# EAGLE design MatrixDriver (EAGLE 6.5.0)
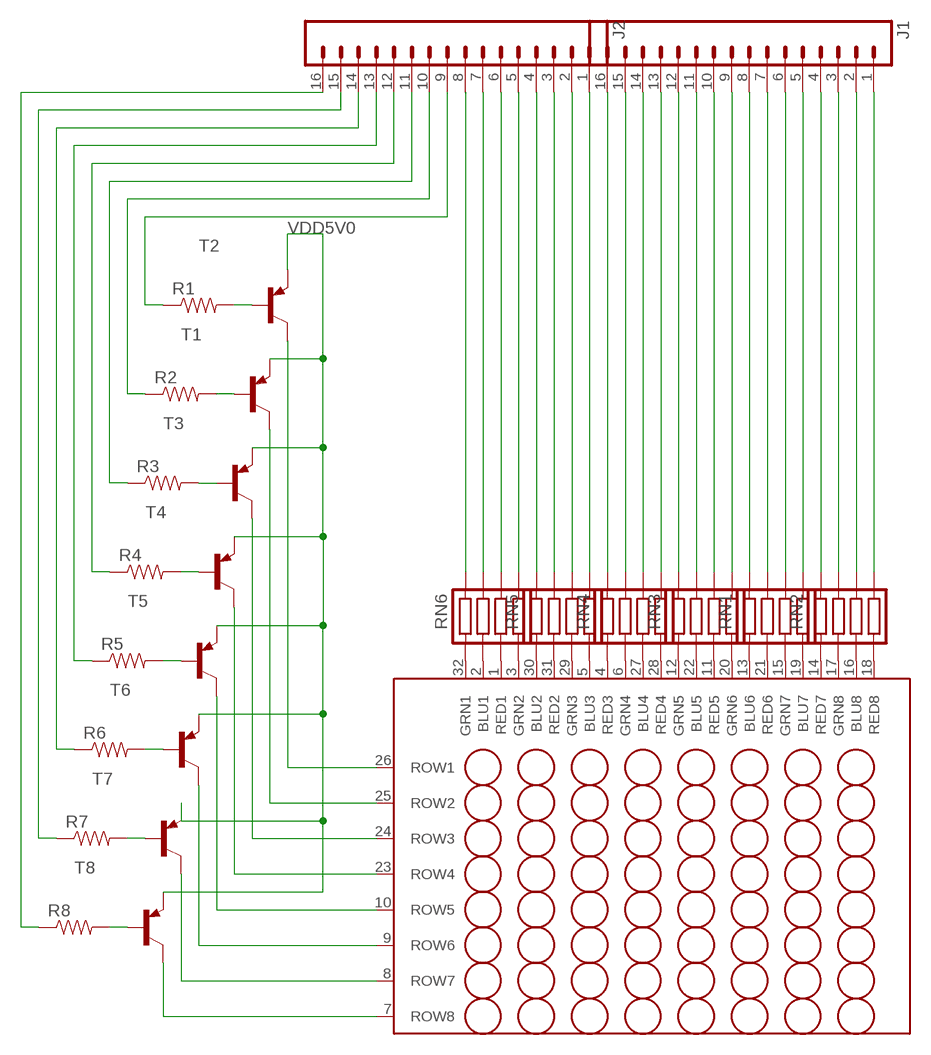
[diagram p0: schematic, sheet 1]

## Parts
J1  M16DUAL_ROW  [2X8]
J2  M16DUAL_ROW  [2X8]
R1  RESISTOR0805-RES  [0805]
R2  RESISTOR0805-RES  [0805]
R3  RESISTOR0805-RES  [0805]
R4  RESISTOR0805-RES  [0805]
R5  RESISTOR0805-RES  [0805]
R6  RESISTOR0805-RES  [0805]
R7  RESISTOR0805-RES  [0805]
R8  RESISTOR0805-RES  [0805]
RN1  RESISTOR_ARRAY-4  [EXB-38V271JV]
RN2  RESISTOR_ARRAY-4  [EXB-38V271JV]
RN3  RESISTOR_ARRAY-4  [EXB-38V271JV]
RN4  RESISTOR_ARRAY-4  [EXB-38V271JV]
RN5  RESISTOR_ARRAY-4  [EXB-38V271JV]
RN6  RESISTOR_ARRAY-4  [EXB-38V271JV]
T1  2N3906-PNP-TO92-EBC  [TO92-EBC]
T2  2N3906-PNP-TO92-EBC  [TO92-EBC]
T3  2N3906-PNP-TO92-EBC  [TO92-EBC]
T4  2N3906-PNP-TO92-EBC  [TO92-EBC]
T5  2N3906-PNP-TO92-EBC  [TO92-EBC]
T6  2N3906-PNP-TO92-EBC  [TO92-EBC]
T7  2N3906-PNP-TO92-EBC  [TO92-EBC]
T8  2N3906-PNP-TO92-EBC  [TO92-EBC]
U$1  BL-M23B88RGB-11  [8X8RGBMATRIX]

## Nets
N$1: T2.C U$1.26(ROW1)
N$2: T1.C U$1.25(ROW2)
N$3: T3.C U$1.24(ROW3)
N$4: T4.C U$1.23(ROW4)
N$5: T5.C U$1.10(ROW5)
N$6: T6.C U$1.9(ROW6)
N$7: T7.C U$1.8(ROW7)
N$8: T8.C U$1.7(ROW8)
N$9: RN1.P$5 U$1.19(BLU7)
N$10: RN1.P$6 U$1.15(GRN7)
N$11: RN1.P$7 U$1.21(RED6)
N$12: RN1.P$8 U$1.13(BLU6)
N$13: RN2.P$5 U$1.18(RED8)
N$14: RN2.P$6 U$1.16(BLU8)
N$15: RN2.P$7 U$1.17(GRN8)
N$16: RN2.P$8 U$1.14(RED7)
N$17: RN3.P$5 U$1.20(GRN6)
N$18: RN3.P$6 U$1.11(RED5)
N$19: RN3.P$7 U$1.22(BLU5)
N$20: RN3.P$8 U$1.12(GRN5)
N$21: RN4.P$5 U$1.28(RED4)
N$22: RN4.P$6 U$1.27(BLU4)
N$23: RN4.P$7 U$1.6(GRN4)
N$24: RN4.P$8 U$1.4(RED3)
N$25: RN5.P$5 U$1.5(BLU3)
N$26: RN5.P$6 U$1.29(GRN3)
N$27: RN5.P$7 U$1.31(RED2)
N$28: RN5.P$8 U$1.30(BLU2)
N$29: RN6.P$5 U$1.3(GRN2)
N$30: RN6.P$6 U$1.1(RED1)
N$31: RN6.P$7 U$1.2(BLU1)
N$32: RN6.P$8 U$1.32(GRN1)
N$33: J1.13 RN4.P$4
N$34: J1.14 RN4.P$3
N$35: J1.15 RN4.P$2
N$36: J1.16 RN4.P$1
N$37: J1.9 RN3.P$4
N$38: J1.10 RN3.P$3
N$39: J1.11 RN3.P$2
N$40: J1.12 RN3.P$1
N$41: J1.5 RN1.P$4
N$42: J1.6 RN1.P$3
N$43: J1.7 RN1.P$2
N$44: J1.8 RN1.P$1
N$45: J1.1 RN2.P$4
N$46: J1.2 RN2.P$3
N$47: J1.3 RN2.P$2
N$48: J1.4 RN2.P$1
N$49: J2.5 RN6.P$4
N$50: J2.6 RN6.P$3
N$51: J2.7 RN6.P$2
N$52: J2.8 RN6.P$1
N$53: J2.1 RN5.P$4
N$54: J2.2 RN5.P$3
N$55: J2.3 RN5.P$2
N$56: J2.4 RN5.P$1
N$57: J2.9 R1.1
N$58: J2.10 R2.1
N$59: J2.11 R3.1
N$60: J2.12 R4.1
N$61: J2.13 R5.1
N$62: J2.14 R6.1
N$63: J2.15 R7.1
N$64: J2.16 R8.1
ROW1: R1.2 T2.B
ROW2: R2.2 T1.B
ROW3: R3.2 T3.B
ROW4: R4.2 T4.B
ROW5: R5.2 T5.B
ROW6: R6.2 T6.B
ROW7: R7.2 T7.B
ROW8: R8.2 T8.B
VDD5V0: T1.E T2.E T3.E T4.E T5.E T6.E T7.E T8.E

## Library data of the parts
J1 J2 = ASL:M16: Header 16 Standard 16-pin 0.1" header. Male version: taken from http://search.digikey.com/scripts/DkSearch/dksus.dll?Detail&name=SAM1034-50-ND Female Version:
R1-R8 = ASL:RESISTOR: Resistor Basic schematic elements and footprints for 0603, 1206, and PTH resistors.
RN1-RN6 = ASL:RESISTOR_ARRAY-4: Chip Resistor Array 4 Single Resistor Source: http://industrial.panasonic.com/www-data/pdf/AOC0000/AOC0000PE2.pdf; OC_FARNELL: unknown; OC_NEWARK: unknown
T1-T8 = transistor-neu-to92:*-PNP-: PNP Transistror
U$1 = pavlo:BL-M23B88RGB-11

## Board
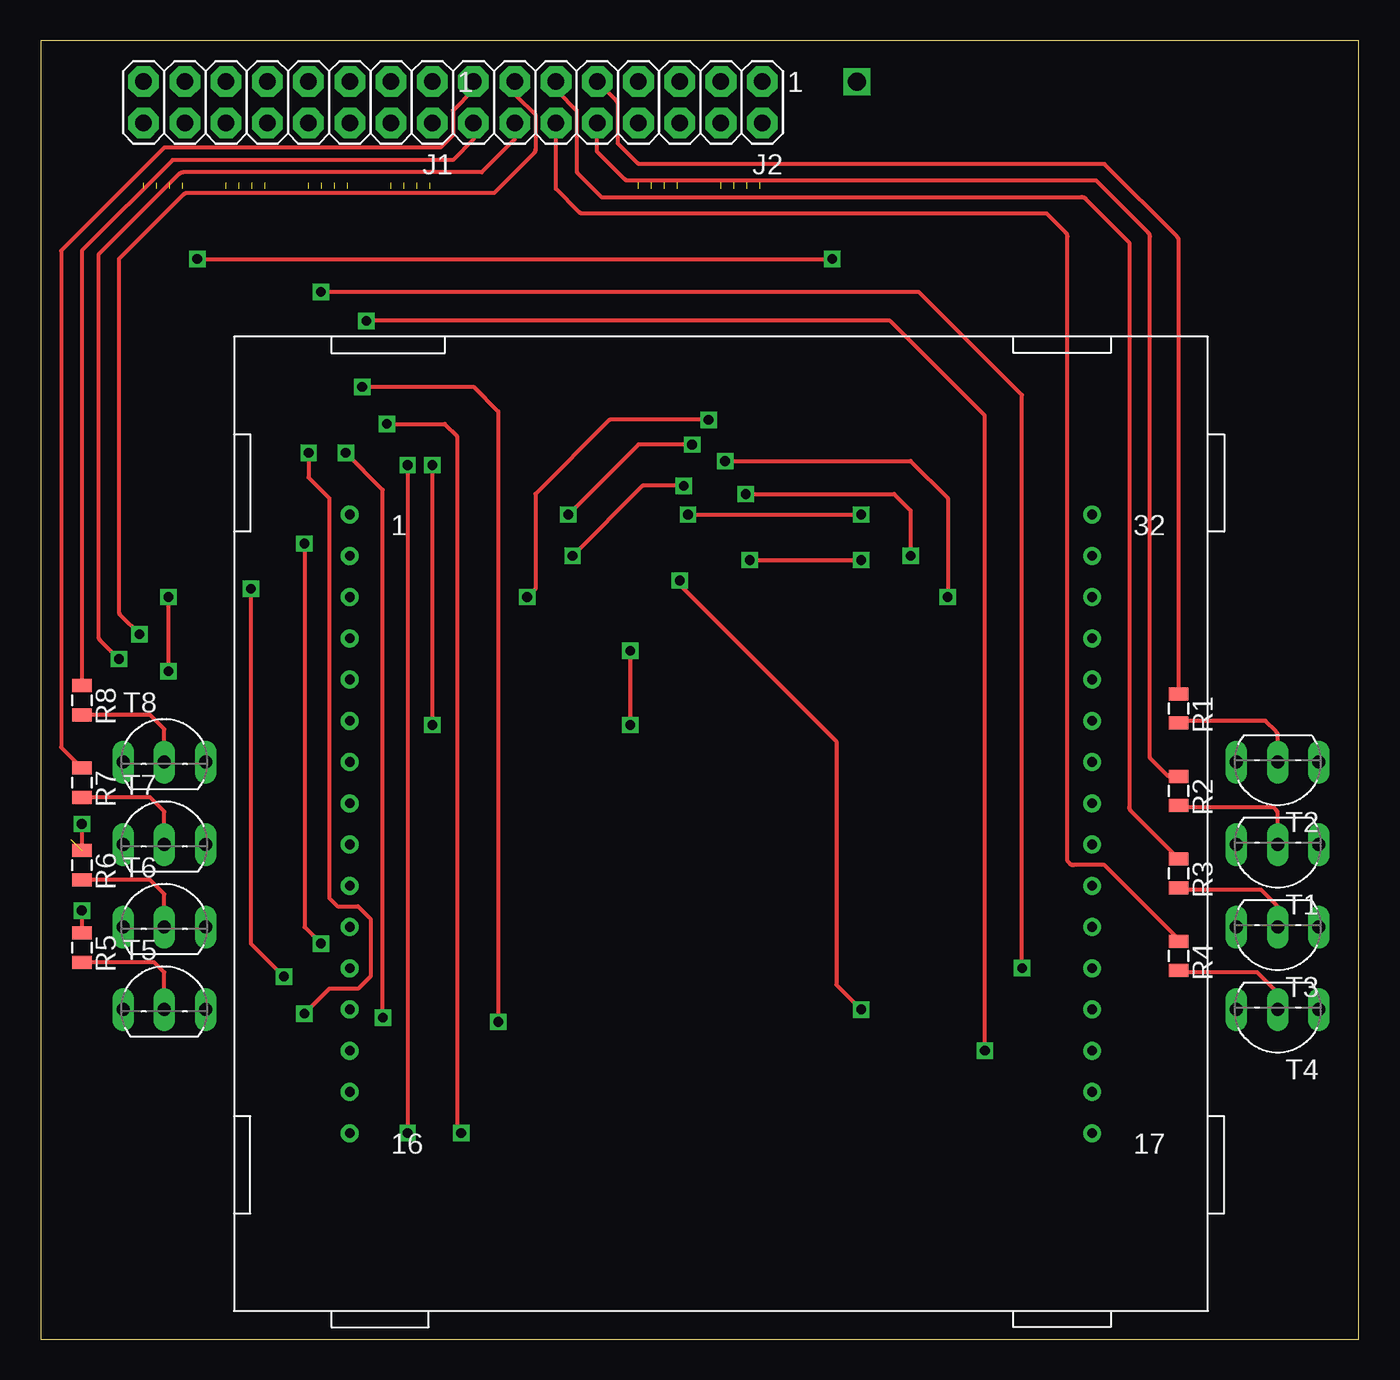
[diagram p1: board, top side]
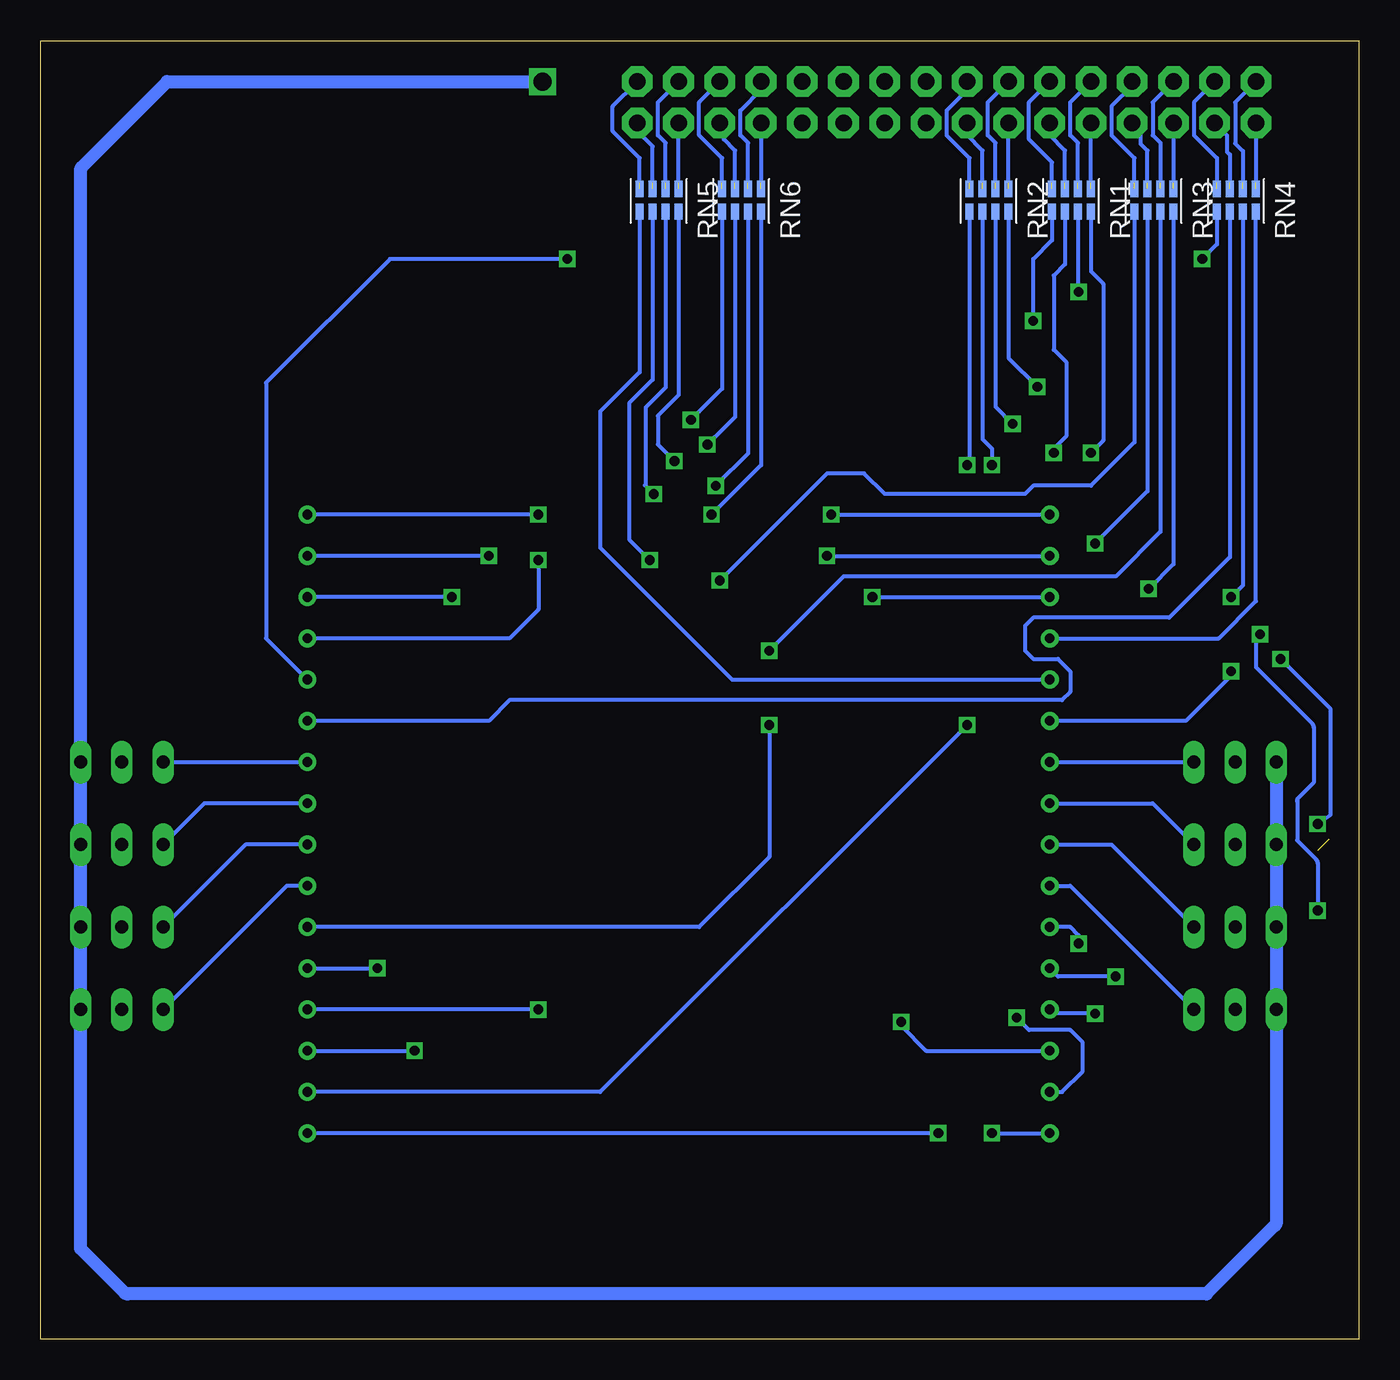
[diagram p2: board, bottom side, seen from below]

Size 81.2 x 80 mm. Coordinates in mm from the lower left corner, seen from the top.
Outline: 0,0 81.2,0 81.2,80 0,80 0,0
Copper layers (1*16): Top 0.035mm / dielectric 1.5mm / Bottom 0.035mm
Design rules "default *": minimum track width 10mil, minimum drill 24mil, track to track 15mil, track to pad 15mil, pad to pad 15mil, via to via 15mil, smd to smd 15mil, copper to edge 40mil, drill to drill 8mil, minimum pad ring 10mil, minimum via ring 8mil, stop-mask expansion 4mil, vias tented up to drill 0mil, thermal gap 10mil

### Footprints (pad centres in the part's own frame; a part is rotated, then mirrored left to right if it is on the bottom)
2X8 = drill 1.016 pad 1.88 octagon: 1 -8.89,-1.27; 2 -8.89,1.27; 3 -6.35,-1.27; 4 -6.35,1.27; 5 -3.81,-1.27; 6 -3.81,1.27; 7 -1.27,-1.27; 8 -1.27,1.27; 9 1.27,-1.27; 10 1.27,1.27; 11 3.81,-1.27; 12 3.81,1.27; 13 6.35,-1.27; 14 6.35,1.27; 15 8.89,-1.27; 16 8.89,1.27
0805 = smd 0.8 x 1.2: 1 -0.9,0; 2 0.9,0
EXB-38V271JV = smd 0.5 x 1: P$1 0,0; P$2 0.8,0; P$3 1.6,0; P$4 2.4,0; P$5 2.4,1.4; P$6 1.6,1.4; P$7 0.8,1.4; P$8 0,1.4
TO92-EBC = drill 0.813 long: B 0,-1.27; C 2.54,-1.27; E -2.54,-1.27
8X8RGBMATRIX = drill 0.6: 1 -22.86,19.05; 2 -22.86,16.51; 3 -22.86,13.97; 4 -22.86,11.43; 5 -22.86,8.89; 6 -22.86,6.35; 7 -22.86,3.81; 8 -22.86,1.27; 9 -22.86,-1.27; 10 -22.86,-3.81; 11 -22.86,-6.35; 12 -22.86,-8.89; 13 -22.86,-11.43; 14 -22.86,-13.97; 15 -22.86,-16.51; 16 -22.86,-19.05; 17 22.86,-19.05; 18 22.86,-16.51; 19 22.86,-13.97; 20 22.86,-11.43; 21 22.86,-8.89; 22 22.86,-6.35; 23 22.86,-3.81; 24 22.86,-1.27; 25 22.86,1.27; 26 22.86,3.81; 27 22.86,6.35; 28 22.86,8.89; 29 22.86,11.43; 30 22.86,13.97; 31 22.86,16.51; 32 22.86,19.05

### Placement (x,y rotation side)
J1  15.24,76.2 180 top
J2  35.56,76.2 180 top
R1  70.1,38.86 270 top
R2  70.1,33.78 270 top
R3  70.1,28.7 270 top
R4  70.1,23.62 270 top
R5  2.54,24.13 270 top
R6  2.54,29.21 270 top
R7  2.54,34.29 270 top
R8  2.54,39.37 270 top
RN1  16.51,70.87 180 bottom
RN2  21.59,70.87 180 bottom
RN3  11.43,70.87 180 bottom
RN4  6.35,70.87 180 bottom
RN5  41.91,70.87 180 bottom
RN6  36.83,70.87 180 bottom
T1  76.2,29.21 180 top
T2  76.2,34.29 180 top
T3  76.2,24.13 180 top
T4  76.2,19.05 180 top
T5  7.62,21.59 0 top
T6  7.62,26.67 0 top
T7  7.62,31.75 0 top
T8  7.62,36.83 0 top
U$1  41.91,31.75 0 top

### Tracks (layer width: path | path; a pad name or v marks a point on that pad's centre or on a via)
N$1
  Bottom 0.254: T2.C U$1.26
N$2
  Bottom 0.254: U$1.25 71.12,33.02 T1.C
N$3
  Bottom 0.254: U$1.24 68.58,30.48 T3.C
N$4
  Bottom 0.254: U$1.23 66.04,27.94 T4.C
N$5
  Bottom 0.254: U$1.10 17.78,27.94 T5.C
N$6
  Bottom 0.254: U$1.9 15.24,30.48 T6.C
N$7
  Bottom 0.254: U$1.8 12.7,33.02 T7.C
N$8
  Bottom 0.254: U$1.7 T8.C
N$9  (via drill 0.6)
  Top 0.254: v58.17,17.78 58.17,56.9 52.32,62.74 v20.07,62.74
  Bottom 0.254: U$1.19 v58.17,17.78 | v20.07,62.74 20.07,66.55 18.91,67.7 RN1.P$5
N$10  (via drill 0.6)
  Top 0.254: v21.08,19.81 21.08,52.32 v18.8,54.61
  Bottom 0.254: U$1.15 18.29,15.24 17.02,16.51 17.02,18.29 17.78,19.05 20.32,19.05 v21.08,19.81 | v18.8,54.61 18.8,54.86 18.03,55.63 18.03,60.2 18.8,60.96 18.8,65.53 18.11,66.22 RN1.P$6
N$11  (via drill 0.6)
  Top 0.254: v60.45,22.86 60.45,58.17 54.1,64.52 v17.27,64.52
  Bottom 0.254: U$1.21 v60.45,22.86 | v17.27,64.52 17.27,69.43 RN1.P$7
N$12  (via drill 0.6)
  Top 0.254: v16.51,54.61 16.51,53.09 17.78,51.82 17.78,27.18 18.29,26.67 19.56,26.67 20.32,25.91 20.32,22.35 19.56,21.59 17.78,21.59 v16.26,20.07
  Bottom 0.254: v16.26,20.07 18.8,20.07 U$1.13 | RN1.P$8 16.51,65.79 15.75,65.02 15.75,55.37 v16.51,54.61
N$13  (via drill 0.6)
  Top 0.254: v24.13,53.85 v24.13,37.85
  Bottom 0.254: RN2.P$5 23.99,53.99 v24.13,53.85 | v24.13,37.85 46.74,15.24 U$1.18
N$14  (via drill 0.6)
  Top 0.254: v22.61,53.85 v22.61,12.7
  Bottom 0.254: RN2.P$6 23.19,55.45 22.61,54.86 v22.61,53.85 | v22.61,12.7 U$1.16
N$15  (via drill 0.6)
  Top 0.254: v21.34,56.39 24.89,56.39 25.65,55.63 25.65,12.95 v25.91,12.7
  Bottom 0.254: RN2.P$7 22.39,57.44 v21.34,56.39 | v25.91,12.7 U$1.17
N$16  (via drill 0.6)
  Top 0.254: v19.81,58.67 26.67,58.67 28.19,57.15 v28.19,19.56
  Bottom 0.254: RN2.P$8 21.59,60.45 v19.81,58.67 | v28.19,19.56 28.19,19.3 26.67,17.78 U$1.14
N$17  (via drill 0.6)
  Top 0.254: v39.37,46.74 39.37,46.48 49.02,36.83 49.02,21.84 v50.55,20.32
  Bottom 0.254: RN3.P$5 13.83,55.26 16.51,52.58 20.07,52.58 20.57,52.07 29.21,52.07 30.48,53.34 32.77,53.34 v39.37,46.74 | v50.55,20.32 U$1.20
N$18  (via drill 0.6)
  Top 0.254: v16.26,49.02 16.26,25.4 v17.27,24.38
  Bottom 0.254: RN3.P$6 13.03,52.25 v16.26,49.02 | v17.27,24.38 17.27,24.89 17.78,25.4 U$1.11
N$19  (via drill 0.6)
  Top 0.254: v36.32,42.42 v36.32,37.85
  Bottom 0.254: RN3.P$7 12.23,49.75 14.99,46.99 31.75,46.99 v36.32,42.42 | v36.32,37.85 36.32,29.72 40.64,25.4 U$1.22
N$20  (via drill 0.6)
  Top 0.254: v12.95,46.23 12.95,24.38 v14.99,22.35
  Bottom 0.254: RN3.P$8 11.43,47.75 v12.95,46.23 | v14.99,22.35 18.54,22.35 U$1.12
N$21  (via drill 0.6)
  Top 0.254: v9.65,66.55 v48.77,66.55
  Bottom 0.254: RN4.P$5 8.75,67.45 v9.65,66.55 | v48.77,66.55 59.69,66.55 67.31,58.93 67.31,43.18 U$1.28
N$22
  Bottom 0.254: RN4.P$6 7.95,48.18 11.68,44.45 20.07,44.45 20.57,43.94 20.57,42.42 20.07,41.91 18.54,41.91 17.78,41.15 17.78,39.88 18.29,39.37 52.32,39.37 53.59,38.1 U$1.27
N$23  (via drill 0.6)
  Top 0.254: v7.87,45.72 v7.87,41.15
  Bottom 0.254: RN4.P$7 7.15,46.44 v7.87,45.72 | v7.87,41.15 7.87,40.89 10.67,38.1 U$1.6
N$24
  Bottom 0.254: U$1.4 8.64,43.18 6.35,45.47 RN4.P$8
N$25
  Bottom 0.254: U$1.5 38.61,40.64 46.74,48.77 46.74,57.15 44.31,59.58 RN5.P$5
N$26  (via drill 0.6)
  Top 0.254: v43.69,48.01 v50.55,48.01
  Bottom 0.254: v43.69,48.01 44.96,49.28 44.96,57.66 43.51,59.11 RN5.P$6 | v50.55,48.01 50.55,44.96 52.32,43.18 U$1.29
N$27  (via drill 0.6)
  Top 0.254: v43.43,52.07 52.58,52.07 53.59,51.05 v53.59,48.26
  Bottom 0.254: v43.43,52.07 43.98,52.62 43.94,52.65 43.94,57.4 42.71,58.64 RN5.P$7 | v53.59,48.26 U$1.31
N$28  (via drill 0.6)
  Top 0.254: v42.16,54.1 53.59,54.1 55.88,51.82 v55.88,45.72
  Bottom 0.254: v42.16,54.1 43.18,55.12 43.18,56.9 41.91,58.17 RN5.P$8 | v55.88,45.72 U$1.30
N$29  (via drill 0.6)
  Top 0.254: v41.15,56.64 35.05,56.64 30.48,52.07 30.48,46.23 v29.97,45.72
  Bottom 0.254: v29.97,45.72 U$1.3 | RN6.P$5 39.23,58.56 v41.15,56.64
N$30  (via drill 0.6)
  Top 0.254: v40.13,55.12 36.83,55.12 v32.51,50.8
  Bottom 0.254: 39.7,55.55 v40.13,55.12 38.43,56.82 RN6.P$6 | v32.51,50.8 U$1.1
N$31  (via drill 0.6)
  Top 0.254: v39.62,52.58 37.08,52.58 v32.77,48.26
  Bottom 0.254: v32.77,48.26 U$1.2 | RN6.P$7 37.63,54.57 v39.62,52.58
N$32  (via drill 0.6)
  Top 0.254: v39.88,50.8 v50.55,50.8
  Bottom 0.254: v39.88,50.8 38.48,52.2 38.1,52.58 36.83,53.85 RN6.P$8 | v50.55,50.8 U$1.32
N$33  (1 unrouted)
  Bottom 0.254: J1.13 10.16,76.2 10.16,74.17 8.75,72.76 8.75,71.25
N$34  (1 unrouted)
  Bottom 0.254: J1.14 8.13,74.17 8.13,73.15 7.95,72.97 7.95,71.25
N$35  (1 unrouted)
  Bottom 0.254: J1.15 7.62,76.2 7.62,73.66 7.15,73.19 7.15,71.25
N$36  (1 unrouted)
  Bottom 0.254: J1.16 6.35,71.25
N$37  (1 unrouted)
  Bottom 0.254: J1.9 13.97,77.22 15.24,75.95 15.24,74.17 13.83,72.76 13.83,71.25
N$38  (1 unrouted)
  Bottom 0.254: J1.10 13.46,74.42 13.46,73.66 13.03,73.23 13.03,71.25
N$39  (1 unrouted)
  Bottom 0.254: J1.11 12.7,76.2 12.7,74.17 12.23,73.7 12.23,71.25
N$40  (1 unrouted)
  Bottom 0.254: J1.12 11.43,71.25
N$41  (1 unrouted)
  Bottom 0.254: 18.91,71.25 18.91,72.5 20.32,73.91 20.32,76.2 J1.5
N$42  (1 unrouted)
  Bottom 0.254: 18.11,71.25 18.11,73.23 19.05,74.17 J1.6
N$43  (1 unrouted)
  Bottom 0.254: 17.31,71.25 17.31,73.7 17.78,74.17 17.78,76.2 J1.7
N$44  (1 unrouted)
  Bottom 0.254: 16.51,71.25 J1.8
N$45  (1 unrouted)
  Bottom 0.254: 23.99,71.25 23.99,72.76 25.4,74.17 25.4,75.69 24.13,76.96 J1.1
N$46  (1 unrouted)
  Bottom 0.254: 23.19,71.25 23.19,73.23 24.13,74.17 J1.2
N$47  (1 unrouted)
  Bottom 0.254: 22.39,71.25 22.39,73.7 22.86,74.17 22.86,76.2 J1.3
N$48  (1 unrouted)
  Bottom 0.254: 21.59,71.25 J1.4
N$49  (1 unrouted)
  Bottom 0.254: 39.23,71.25 39.23,72.76 40.64,74.17 40.64,76.2 J2.5
N$50  (1 unrouted)
  Bottom 0.254: 38.43,71.25 38.43,73.23 39.12,73.91 39.12,74.68 J2.6
N$51  (1 unrouted)
  Bottom 0.254: J2.7 36.83,76.96 38.1,75.69 38.1,74.17 37.63,73.7 37.63,71.25
N$52  (1 unrouted)
  Bottom 0.254: J2.8 36.83,71.25
N$53  (1 unrouted)
  Bottom 0.254: 44.31,71.25 44.31,72.76 45.97,74.42 45.97,75.95 J2.1
N$54  (1 unrouted)
  Bottom 0.254: 43.51,71.25 43.51,73.48 44.45,74.42 J2.2
N$55  (1 unrouted)
  Bottom 0.254: 42.71,71.25 42.71,73.7 43.18,74.17 43.18,76.2 J2.3
N$56  (1 unrouted)
  Bottom 0.254: 41.91,71.25 J2.4
N$57
  Top 0.254: R1.1 70.1,67.69 arc45 70.01,67.91 65.53,72.39 36.96,72.39 arc-45 36.74,72.48 35.56,73.66 35.56,76.07 arc45 35.47,76.29 J2.9
N$58
  Top 0.254: R2.1 69.59,34.68 arc-45 69.36,34.77 68.33,35.81 68.33,67.94 arc45 68.23,68.17 65.02,71.37 36.2,71.37 arc-45 35.98,71.47 34.29,73.15 34.29,74.04 arc-45 34.38,74.26 34.54,74.42 34.54,74.54 arc45 34.45,74.77 J2.10
N$59
  Top 0.254: J2.11 31.75,77.09 arc45 31.84,76.87 33.02,75.69 33.02,72.01 arc45 33.11,71.79 34.54,70.36 64.13,70.36 arc-45 64.36,70.27 67.06,67.56 67.06,32.78 arc45 67.15,32.56 R3.1
N$60
  Top 0.254: R4.1 arc45 70.02,24.72 65.53,29.21 63.63,29.21 arc-45 63.41,29.3 63.25,29.46 63.25,67.94 arc45 63.15,68.17 61.98,69.34 33.41,69.34 arc-45 33.18,69.44 31.75,70.87 J2.12
N$61  (via drill 0.6)
  Top 0.254: J2.13 29.21,76.84 arc45 29.3,76.61 30.48,75.44 30.48,73.28 arc-45 30.39,73.06 27.94,70.61 9.02,70.61 arc45 8.8,70.52 4.83,66.55 4.83,44.84 arc45 4.92,44.61 v6.1,43.43 | v2.54,26.42 R5.1
  Bottom 0.254: v6.1,43.43 6.26,43.27 arc-45 6.35,43.05 6.35,41.4 2.89,37.94 arc45 2.79,37.71 2.79,34.29 3.72,33.37 arc-45 3.81,33.14 3.81,30.73 2.63,29.56 arc45 2.54,29.33 v2.54,26.42
N$62  (via drill 0.6)  (2 unrouted)
  Top 0.254: J2.14 29.21,73.91 27.18,71.88 8.77,71.88 arc45 8.54,71.79 3.56,66.8 3.56,43.31 arc45 3.65,43.09 v4.83,41.91 | v2.54,31.75 R6.1
  Bottom 0.254: v4.83,41.91 1.78,38.86 1.78,32.27 v2.54,31.75
N$63
  Top 0.254: J2.15 26.67,76.96 25.4,75.69 25.4,74.17 24.64,73.41 7.62,73.41 1.27,67.06 1.27,36.46 R7.1
N$64
  Top 0.254: J2.16 26.67,73.91 25.4,72.64 8.13,72.64 2.54,67.06 R8.1
ROW1
  Top 0.254: T2.B 76.2,37.21 arc45 76.11,37.43 75.44,38.1 70.37,38.1 arc45 70.15,38.01 R1.2
ROW2
  Top 0.254: T1.B 76.2,32.38 arc45 76.11,32.6 75.95,32.77 70.35,32.77 arc-45 70.13,32.86 R2.2
ROW3
  Top 0.254: T3.B 76.2,26.54 arc45 76.11,26.76 75.18,27.69 70.35,27.69 arc-45 70.13,27.78 R3.2
ROW4
  Top 0.254: T4.B 76.2,21.2 arc45 76.11,21.43 74.93,22.61 70.35,22.61 arc-45 70.13,22.7 R4.2
ROW5
  Top 0.254: T5.B 7.62,22.61 7,23.23 R5.2
ROW6
  Top 0.254: T6.B 7.62,27.43 6.74,28.31 R6.2
ROW7
  Top 0.254: T7.B 7.62,32.51 6.74,33.39 R7.2
ROW8
  Top 0.254: T8.B 7.62,37.59 6.74,38.47 R8.2
VDD5V0  (via drill 1.1)
  Bottom 0.813: T8.E T7.E T6.E T5.E 5.08,7.24 arc45 5.17,7.02 9.4,2.79 75.81,2.79 arc45 76.04,2.89 78.74,5.59 T4.E T3.E T1.E T2.E 78.74,72 arc45 78.65,72.23 73.41,77.47 v50.29,77.47